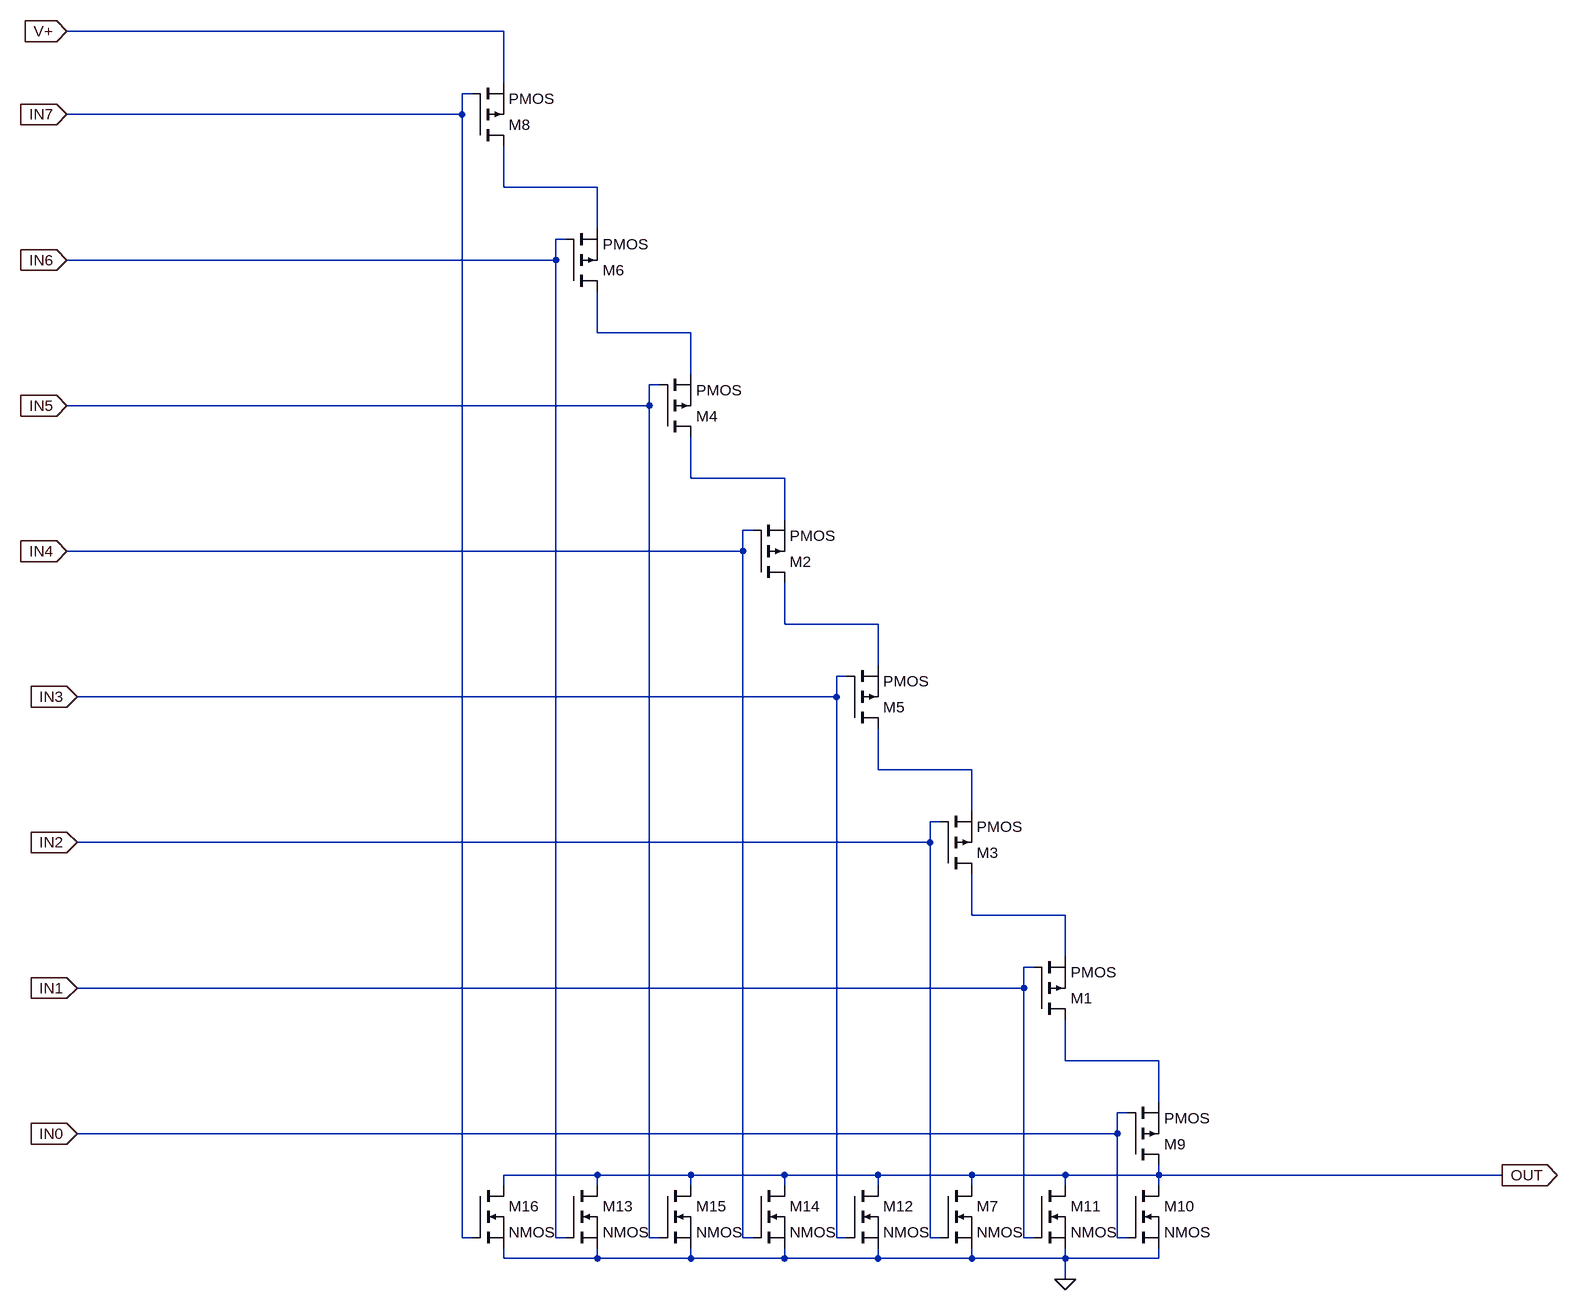
[diagram p0: schematic 8-NAND.asc]
8-NAND.asc, the LTspice schematic file:
Version 4
SHEET 1 1660 1104
WIRE 32 -1504 -640 -1504
WIRE 32 -1424 32 -1504
WIRE -16 -1408 -32 -1408
WIRE -32 -1376 -32 -1408
WIRE -32 -1376 -640 -1376
WIRE 32 -1264 32 -1328
WIRE 176 -1264 32 -1264
WIRE 176 -1200 176 -1264
WIRE 128 -1184 112 -1184
WIRE 112 -1152 112 -1184
WIRE 112 -1152 -640 -1152
WIRE 176 -1040 176 -1104
WIRE 320 -1040 176 -1040
WIRE 320 -976 320 -1040
WIRE 272 -960 256 -960
WIRE 256 -928 256 -960
WIRE 256 -928 -640 -928
WIRE 320 -816 320 -880
WIRE 464 -816 320 -816
WIRE 464 -752 464 -816
WIRE 416 -736 400 -736
WIRE 400 -704 400 -736
WIRE 400 -704 -640 -704
WIRE 464 -592 464 -656
WIRE 608 -592 464 -592
WIRE 608 -528 608 -592
WIRE 560 -512 544 -512
WIRE 544 -480 544 -512
WIRE 544 -480 -624 -480
WIRE 608 -368 608 -432
WIRE 752 -368 608 -368
WIRE 752 -304 752 -368
WIRE 704 -288 688 -288
WIRE 688 -256 688 -288
WIRE 688 -256 -624 -256
WIRE 752 -144 752 -208
WIRE 896 -144 752 -144
WIRE 896 -80 896 -144
WIRE 848 -64 832 -64
WIRE 832 -32 832 -64
WIRE 832 -32 -624 -32
WIRE 896 80 896 16
WIRE 1040 80 896 80
WIRE 1040 144 1040 80
WIRE 992 160 976 160
WIRE 976 192 976 160
WIRE 976 192 -624 192
WIRE 176 256 32 256
WIRE 320 256 176 256
WIRE 464 256 320 256
WIRE 608 256 464 256
WIRE 752 256 608 256
WIRE 896 256 752 256
WIRE 1040 256 1040 240
WIRE 1040 256 896 256
WIRE 1568 256 1040 256
WIRE 32 272 32 256
WIRE 176 272 176 256
WIRE 320 272 320 256
WIRE 464 272 464 256
WIRE 608 272 608 256
WIRE 752 272 752 256
WIRE 896 272 896 256
WIRE 1040 272 1040 256
WIRE -32 352 -32 -1376
WIRE -16 352 -32 352
WIRE 112 352 112 -1152
WIRE 128 352 112 352
WIRE 256 352 256 -928
WIRE 272 352 256 352
WIRE 400 352 400 -704
WIRE 416 352 400 352
WIRE 544 352 544 -480
WIRE 560 352 544 352
WIRE 688 352 688 -256
WIRE 704 352 688 352
WIRE 832 352 832 -32
WIRE 848 352 832 352
WIRE 976 352 976 192
WIRE 992 352 976 352
WIRE 32 384 32 368
WIRE 176 384 176 368
WIRE 176 384 32 384
WIRE 320 384 320 368
WIRE 320 384 176 384
WIRE 464 384 464 368
WIRE 464 384 320 384
WIRE 608 384 608 368
WIRE 608 384 464 384
WIRE 752 384 752 368
WIRE 752 384 608 384
WIRE 896 384 896 368
WIRE 896 384 752 384
WIRE 1040 384 1040 368
WIRE 1040 384 896 384
WIRE 896 416 896 384
FLAG 896 416 0
FLAG 1568 256 OUT
IOPIN 1568 256 Out
FLAG -640 -1504 V+
IOPIN -640 -1504 In
FLAG -624 -480 IN3
IOPIN -624 -480 In
FLAG -624 -256 IN2
IOPIN -624 -256 In
FLAG -624 -32 IN1
IOPIN -624 -32 In
FLAG -624 192 IN0
IOPIN -624 192 In
FLAG -640 -1376 IN7
IOPIN -640 -1376 In
FLAG -640 -1152 IN6
IOPIN -640 -1152 In
FLAG -640 -928 IN5
IOPIN -640 -928 In
FLAG -640 -704 IN4
IOPIN -640 -704 In
SYMBOL pmos 992 240 M180
SYMATTR InstName M9
SYMBOL pmos 848 16 M180
SYMATTR InstName M1
SYMBOL pmos 704 -208 M180
SYMATTR InstName M3
SYMBOL pmos 560 -432 M180
SYMATTR InstName M5
SYMBOL nmos 704 272 R0
SYMATTR InstName M7
SYMBOL nmos 992 272 R0
SYMATTR InstName M10
SYMBOL nmos 848 272 R0
SYMATTR InstName M11
SYMBOL nmos 560 272 R0
SYMATTR InstName M12
SYMBOL pmos 416 -656 M180
SYMATTR InstName M2
SYMBOL pmos 272 -880 M180
SYMATTR InstName M4
SYMBOL pmos 128 -1104 M180
SYMATTR InstName M6
SYMBOL pmos -16 -1328 M180
SYMATTR InstName M8
SYMBOL nmos 128 272 R0
SYMATTR InstName M13
SYMBOL nmos 416 272 R0
SYMATTR InstName M14
SYMBOL nmos 272 272 R0
SYMATTR InstName M15
SYMBOL nmos -16 272 R0
SYMATTR InstName M16

The netlist it stands for:
* 8-NAND.asc
M9 OUT IN0 N007 N007 PMOS
M1 N007 IN1 N006 N006 PMOS
M3 N006 IN2 N005 N005 PMOS
M5 N005 IN3 N004 N004 PMOS
M7 OUT IN2 0 0 NMOS
M10 OUT IN0 0 0 NMOS
M11 OUT IN1 0 0 NMOS
M12 OUT IN3 0 0 NMOS
M2 N004 IN4 N003 N003 PMOS
M4 N003 IN5 N002 N002 PMOS
M6 N002 IN6 N001 N001 PMOS
M8 N001 IN7 V+ V+ PMOS
M13 OUT IN6 0 0 NMOS
M14 OUT IN4 0 0 NMOS
M15 OUT IN5 0 0 NMOS
M16 OUT IN7 0 0 NMOS
.model NMOS NMOS
.model PMOS PMOS
.lib standard.mos
.backanno
.end